# EAGLE schematic overview (EAGLE 7.6.0)
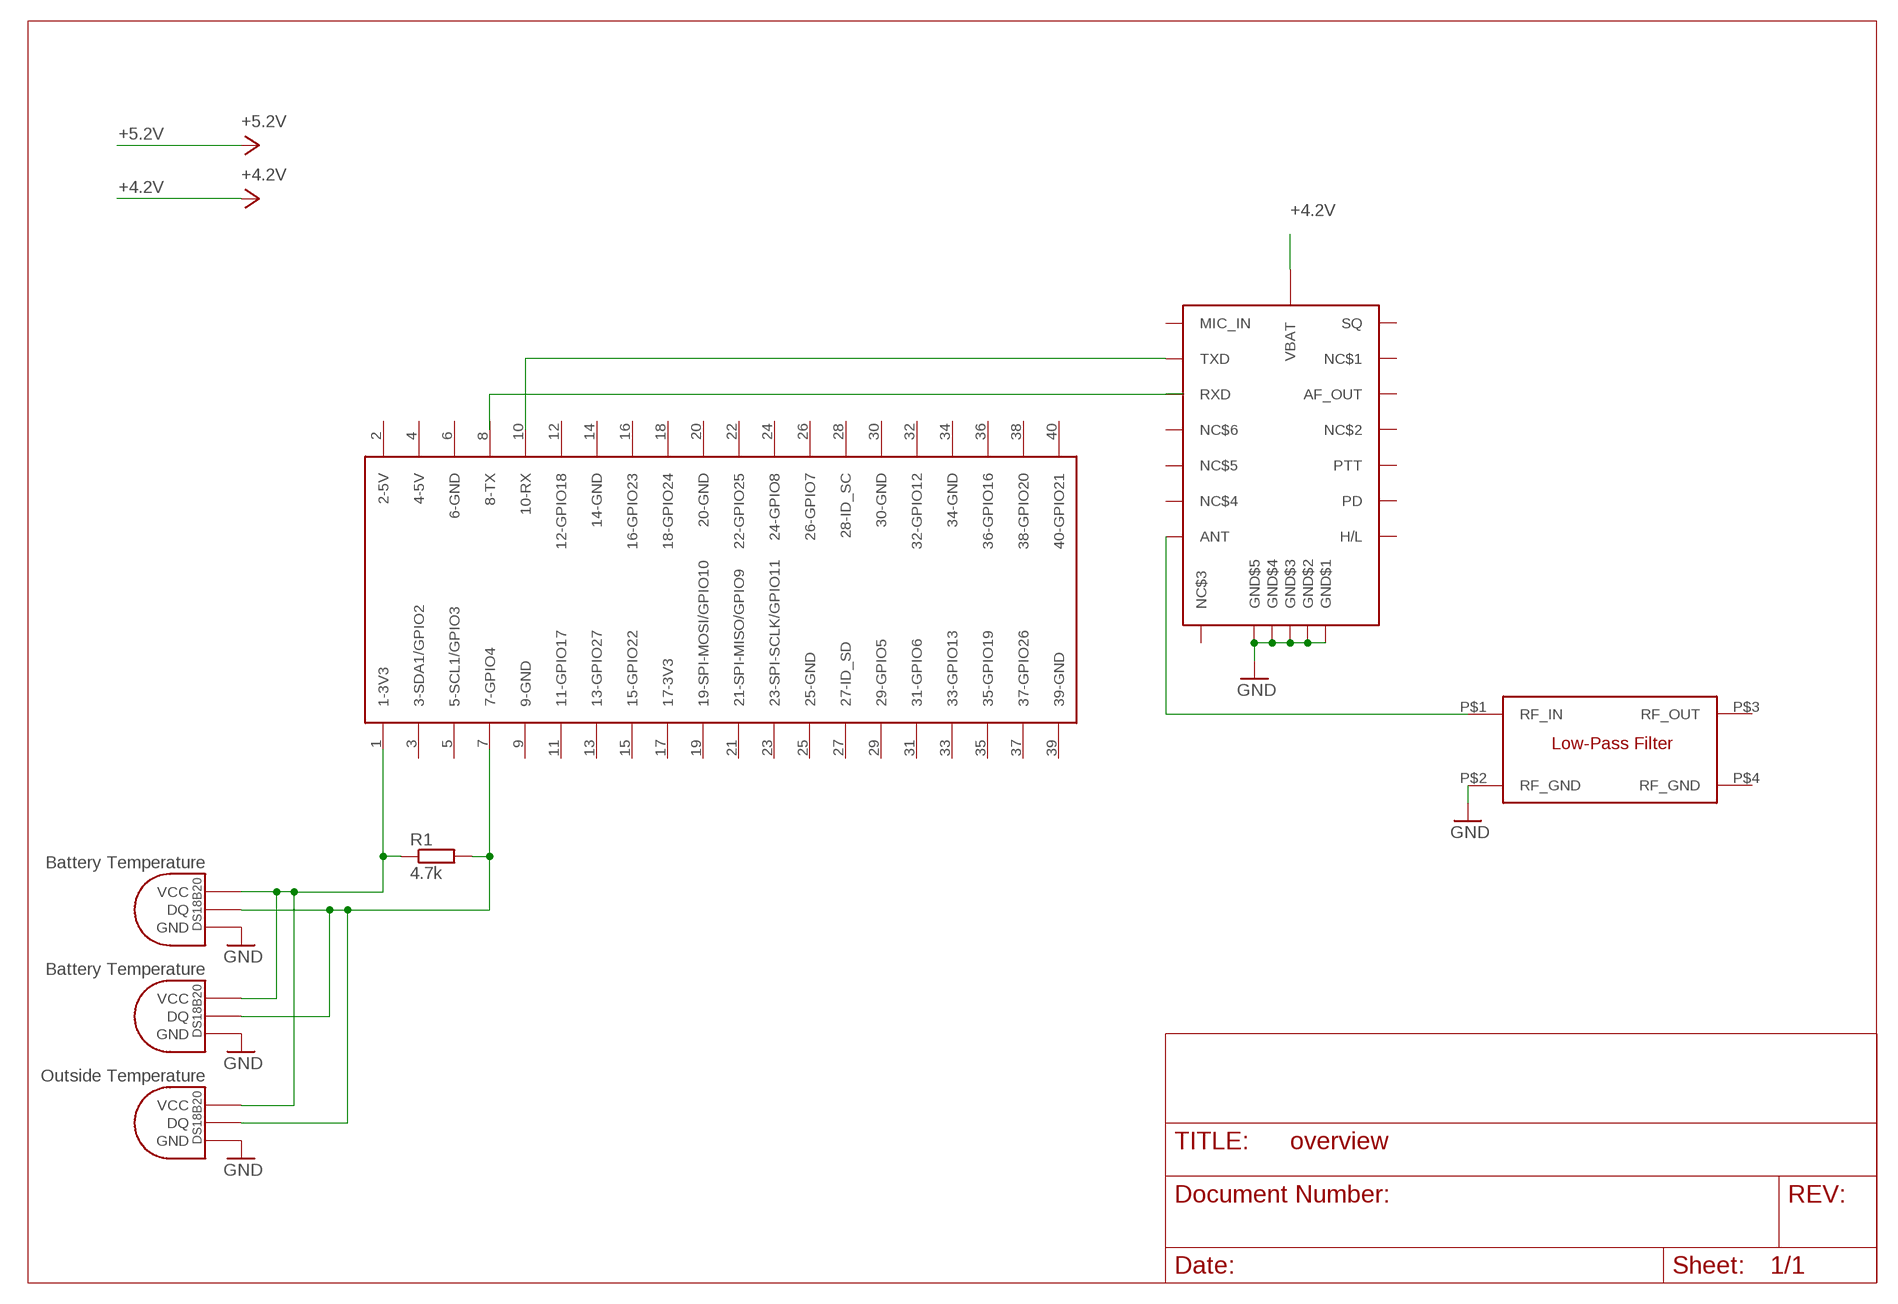
[diagram p0: schematic, sheet 1]

## Parts
BATT_TEMPERATURE  DS1820TO92-BATT  DS1820TO92  [DS1820]
R1  4.7k  R-EU_0207/7  [0207/7]
U1  DRA818  [DORJI_MODULE]
U$1  LPF_160MHZ  [DUMMY_PACKAGE]
U$2  RASPBERRY-PI+HEADERONLY  [RASPBERRY-PI-PLUS-HEADERONLY]
U$4  DS1820TO92  [DS1820]
U$5  DS1820TO92  [DS1820]

## Nets
+4.2V: U1.P$8(VBAT)
GND: BATT_TEMPERATURE.GND U1.P$9(GND$1) U1.P$10(GND$2) U1.P$19(GND$3) U1.P$20(GND$4) U1.P$21(GND$5) U$1.P$2(RF_GND) U$4.GND U$5.GND
N$1: U1.P$12(ANT) U$1.P$1(RF_IN)
N$2: U1.P$16(RXD)
N$3: U1.P$17(TXD)
N$4: BATT_TEMPERATURE.DQ R1.2 U$4.DQ U$5.DQ
N$5: BATT_TEMPERATURE.VDD(VCC) R1.1 U$4.VDD(VCC) U$5.VDD(VCC)
Unconnected: U1.P$1(SQ) U1.P$2(NC$1) U1.P$3(AF_OUT) U1.P$4(NC$2) U1.P$5(PTT) U1.P$6(PD) U1.P$7(H/L) U1.P$11(NC$3) U1.P$13(NC$4) U1.P$14(NC$5) U1.P$15(NC$6) U1.P$18(MIC_IN) U$1.P$3(RF_OUT) U$1.P$4(RF_GND) U$2.1(1-3V3) U$2.2(2-5V) U$2.3(3-SDA1/GPIO2) U$2.4(4-5V) U$2.5(5-SCL1/GPIO3) U$2.6(6-GND) U$2.7(7-GPIO4) U$2.8(8-TX) U$2.9(9-GND) U$2.10(10-RX) U$2.11(11-GPIO17) U$2.12(12-GPIO18) U$2.13(13-GPIO27) U$2.14(14-GND) U$2.15(15-GPIO22) U$2.16(16-GPIO23) U$2.17(17-3V3) U$2.18(18-GPIO24) U$2.19(19-SPI-MOSI/GPIO10) U$2.20(20-GND) U$2.21(21-SPI-MISO/GPIO9) U$2.22(22-GPIO25) U$2.23(23-SPI-SCLK/GPIO11) U$2.24(24-GPIO8) U$2.25(25-GND) U$2.26(26-GPIO7) U$2.27(27-ID_SD) U$2.28(28-ID_SC) U$2.29(29-GPIO5) U$2.30(30-GND) U$2.31(31-GPIO6) U$2.32(32-GPIO12) U$2.33(33-GPIO13) U$2.34(34-GND) U$2.35(35-GPIO19) U$2.36(36-GPIO16) U$2.37(37-GPIO26) U$2.38(38-GPIO20) U$2.39(39-GND) U$2.40(40-GPIO21)

## Notes on the sheet
- Battery Temperature
- Battery Temperature
- Outside Temperature

## Library data of the parts
BATT_TEMPERATURE U$4 U$5 = Ava:DS1820: DS18B20 Programmable Resolution 1-Wire Digital Thermometer Description The DS18B20 digital thermometer provides 9-bit to 12-bit Celsius temperature measurements and has an alarm function with nonvolatile user-programmable upper and lower trigger points. The DS18B20 communicates over a 1-Wire® bus that by definition requires only one data line (and ground) for communication with a central microprocessor. It has an operating temperature range of -55°C to +125°C and is accurate to ±0.5°C over the range of -10°C to +85°C. In addition, the DS18B20 can derive power directly from the data line ("parasite power"), eliminating the need for an external power supply. Each DS18B20 has a unique 64-bit serial code, which allows multiple DS18B20s to function on the same 1-Wire bus. Thus, it is simple to use one microprocessor to control many DS18B20s distributed over a large area. Applications that can benefit from this feature include HVAC environmental controls, temperature monitoring systems inside buildings, equipment, or machinery, and process monitoring and control systems.
R1 = resistor:R-EU_: RESISTOR, European symbol
U1 = dorji_module:DRA818
U$1 = martins-parts:LPF_160MHZ
U$2 = Ava:RASPBERRY-PI+: Samtec SSW-120-01-T-D

## Module ACS714
Ports: 

### Library data of the parts